# Altium project Forward_Project.PrjPcb
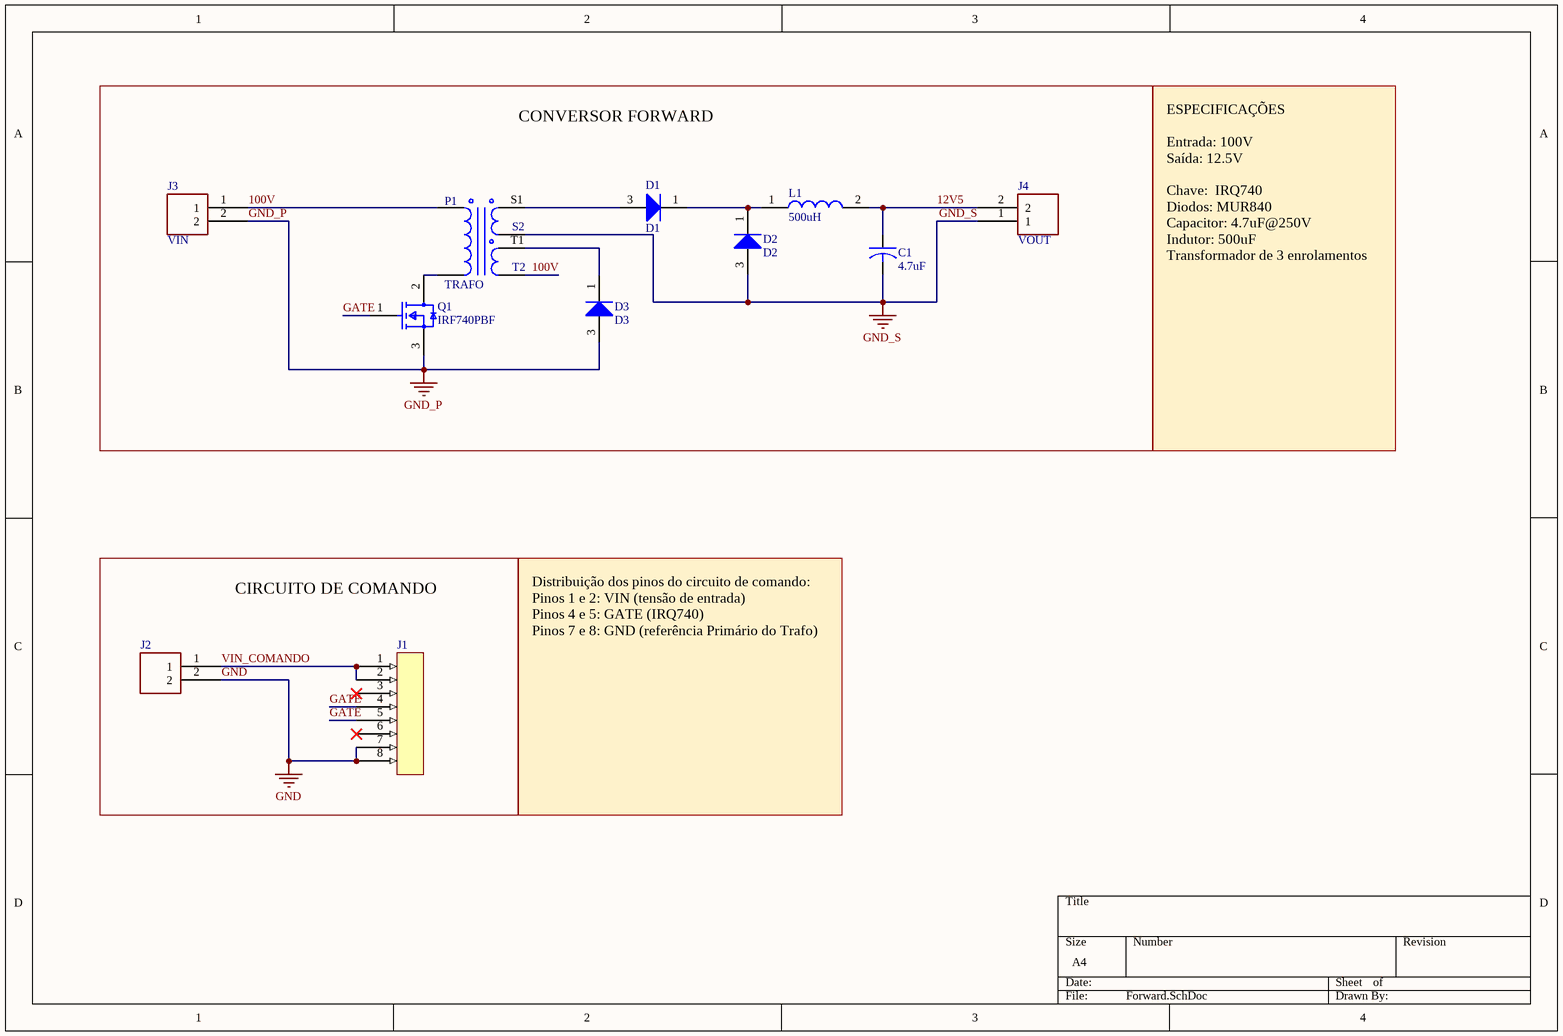
[diagram p0: Forward.SchDoc]
Author: Rebecca Quintino Do Ó e Felipe Pastana; CheckedBy: Prof. Telles Brunneli Lazzarin D. Eng.; Revision: 0.1; Title: Conversor Forward
1 sheet, 11 parts. Net scope: global (net labels, ports and power ports of the same name join across sheets).
Board file: Forward.PcbDoc

## Sheet Forward.SchDoc: Conversor Forward
size A4; Author: Rebecca Quintino Do Ó e Felipe Pastana; SheetNumber: 1; SheetTotal: 1

### Parts
C1  4.7uF  [Capacitor]
D1  D1  [MUR840]
D2  D2  [MUR840]
D3  D3  [MUR840]
J1  header 8pin  [Header 8pin]  (value not drawn)
J2  Con_Molex_2_pin  [CON_MOLEX_2_vias]  (value not drawn)
J3  VIN  [CON_MOLEX_2_vias]
J4  VOUT  [Borne_KRE_2pin]
L1  500uH  [Indutor]
Q1  IRF740PBF  [FP-X15-0364-MFG]
TRAFO  Trafo  [Trafo_NEE_30/14]  (value not drawn)

### Blocks framed on the sheet
CONVERSOR FORWARD: C1 D1-D3 J3 J4 L1 Q1 TRAFO
CIRCUITO DE COMANDO: J1 J2

### Nets
GND: J1.7 J1.8 J2.2
GND_P: D3.3(A) J3.2 Q1.3(S)
GND_S: C1.2 D2.3(A) J4.1 TRAFO.S2
12V5: C1.1 J4.2 L1.2
100V: J3.1 TRAFO.P1 TRAFO.S2
GATE: J1.4 J1.5 Q1.1(G)
VIN_COMANDO: J1.1 J1.2 J2.1
NetD1_1: D1.1(K) D2.1(K) L1.1
NetD1_3: D1.3(A) TRAFO.S1
NetD3_1: D3.1(K) TRAFO.T1
NetQ1_2: Q1.2(D) TRAFO.P2(gg)

Not connected (* = marked no-connect by the designer): J1 3* 6*

### Notes on the sheet
- ESPECIFICAÇÕES
  Entrada: 100V
  Saída: 12.5V
  Chave:  IRQ740
  Diodos: MUR840
  Capacitor: 4.7uF@250V
  Indutor: 500uF
  Transformador de 3 enrolamentos
- Distribuição dos pinos do circuito de comando:
  Pinos 1 e 2: VIN (tensão de entrada)
  Pinos 4 e 5: GATE (IRQ740)
  Pinos 7 e 8: GND (referência Primário do Trafo)
- (in symbol Trafo) T2

### Library data of the parts
C1 = Capacitor Eletro
D1-D3 = mur840
J3 = Con_Molex_2_pin
J4 = Borne_KRE_2_vias
L1 = Indutor
Q1 = CMP-013-00035-1: Power Field-Effect Transistor, 10A I(D), 400V, 0.55ohm, 1-Element, N-Channel, Silicon, Metal-oxide Semiconductor FET, TO-220AB; Max Operating Temperature: 150°C; Pins: 3; RoHS Compliant: Yes
TRAFO = Trafo: Transformador de 3 enrolamentos